# EAGLE design layoutprocessadorsch (EAGLE 9.0.0)
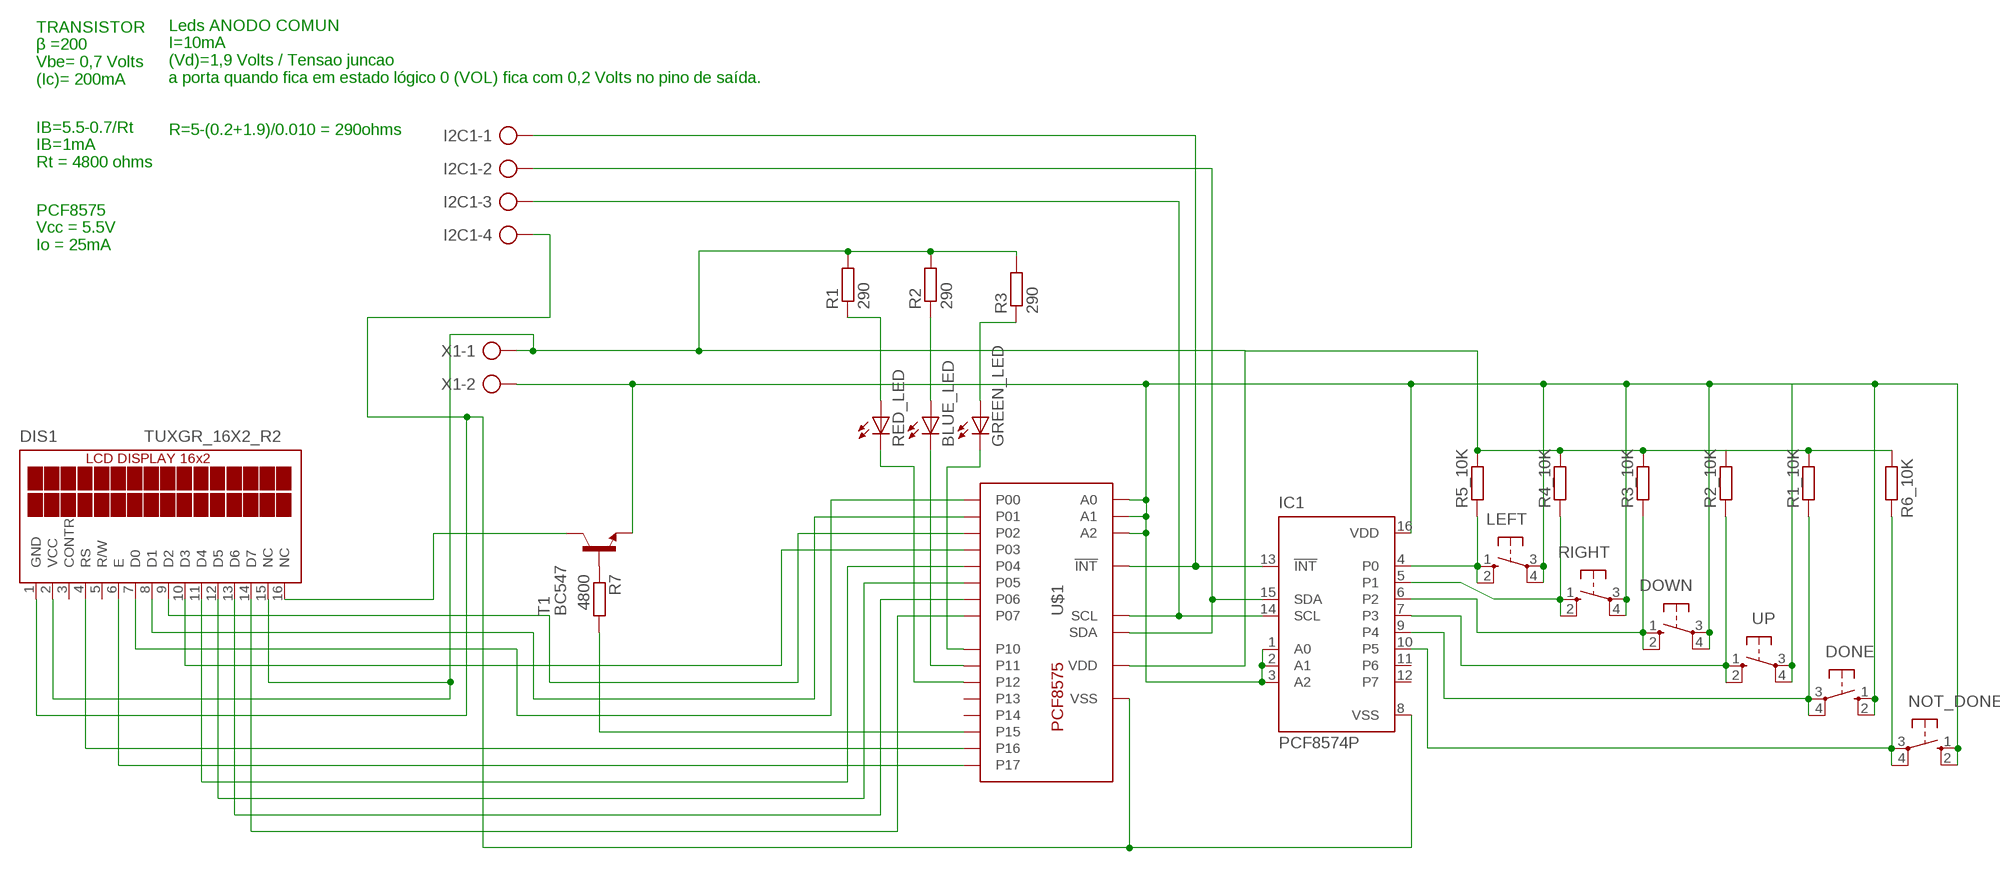
[diagram p0: schematic, sheet 1]

## Parts
BLUE_LED  LED5MM  [LED5MM]
DIS1  TUXGR_16X2_R2  [TUXGR_16X2_R2]
DONE  10-XX  [B3F-10XX]
DOWN  10-XX  [B3F-10XX]
GREEN_LED  LED5MM  [LED5MM]
I2C1  AK500/4-H  [AK500/4-H]
IC1  PCF8574P  [DIL16]
LEFT  10-XX  [B3F-10XX]
NOT_DONE  10-XX  [B3F-10XX]
R1  290  R-EU_0207/7  [0207/7]
R1_10K  R-EU_0207/7  [0207/7]
R2  290  R-EU_0207/7  [0207/7]
R2_10K  R-EU_0207/7  [0207/7]
R3  290  R-EU_0207/7  [0207/7]
R3_10K  R-EU_0207/7  [0207/7]
R4_10K  R-EU_0207/7  [0207/7]
R5_10K  R-EU_0207/7  [0207/7]
R6_10K  R-EU_0207/7  [0207/7]
R7  4800  R-EU_0207/7  [0207/7]
RED_LED  LED5MM  [LED5MM]
RIGHT  10-XX  [B3F-10XX]
T1  BC547  [TO92]
U$1  PCF8575C  [SOP24]
UP  10-XX  [B3F-10XX]
X1  AK500/2-H  [AK500/2-H]

## Nets
N$1: DIS1.14(D7) U$1.P$11(P07)
N$2: R7.1 T1.2(B)
N$3: I2C1.1 IC1.13(!INT) U$1.P$1(!INT)
N$4: I2C1.2 IC1.15(SDA) U$1.P$23(SDA)
N$5: DIS1.7(D0) U$1.P$4(P00)
N$6: DIS1.8(D1) U$1.P$5(P01)
N$7: DIS1.9(D2) U$1.P$6(P02)
N$8: DIS1.10(D3) U$1.P$7(P03)
N$9: DIS1.1(GND) I2C1.4 IC1.8(VSS) U$1.P$12(VSS)
N$10: DIS1.6(E) U$1.P$20(P17)
N$11: DIS1.4(RS) U$1.P$19(P16)
N$12: I2C1.3 IC1.14(SCL) U$1.P$22(SCL)
N$13: DIS1.11(D4) U$1.P$8(P04)
N$14: DIS1.12(D5) U$1.P$9(P05)
N$15: DIS1.13(D6) U$1.P$10(P06)
N$16: R7.2 U$1.P$18(P15)
N$17: DIS1.16(NC) T1.3(C)
N$18: GREEN_LED.K(C) U$1.P$13(P10)
N$19: IC1.4(P0) LEFT.1(S) LEFT.2(S1) R5_10K.1
N$20: IC1.5(P1) R4_10K.1 RIGHT.1(S) RIGHT.2(S1)
N$22: DOWN.1(S) DOWN.2(S1) IC1.6(P2) R3_10K.1
N$23: DIS1.2(VCC) DIS1.15(NC) R1.2 R1_10K.2 R2.2 R2_10K.2 R3.2 R3_10K.2 R4_10K.2 R5_10K.2 R6_10K.1 U$1.P$24(VDD) X1.1
N$24: DONE.3(P) DONE.4(P1) IC1.9(P4) R1_10K.1
N$26: IC1.10(P5) NOT_DONE.3(P) NOT_DONE.4(P1) R6_10K.2
N$28: IC1.7(P3) R2_10K.1 UP.1(S) UP.2(S1)
N$29: BLUE_LED.K(C) U$1.P$14(P11)
N$30: RED_LED.K(C) U$1.P$15(P12)
N$31: R1.1 RED_LED.A
N$32: BLUE_LED.A R2.1
N$33: GREEN_LED.A R3.1
N$35: DONE.1(S) DONE.2(S1) DOWN.3(P) DOWN.4(P1) IC1.1(A0) IC1.2(A1) IC1.3(A2) IC1.16(VDD) LEFT.3(P) LEFT.4(P1) NOT_DONE.1(S) NOT_DONE.2(S1) RIGHT.3(P) RIGHT.4(P1) T1.1(E) U$1.P$2(A1) U$1.P$3(A2) U$1.P$21(A0) UP.3(P) UP.4(P1) X1.2
Unconnected: DIS1.3(CONTR) DIS1.5(R/W) IC1.11(P6) IC1.12(P7) U$1.P$16(P13) U$1.P$17(P14)

## Notes on the sheet
- TRANSISTOR
  β =200
  Vbe= 0,7 Volts
  (Ic)= 200mA
- Leds ANODO COMUN
  I=10mA
  (Vd)=1,9 Volts / Tensao juncao
  a porta quando fica em estado lógico 0 (VOL) fica com 0,2 Volts no pino de saída.
  
  
  R=5-(0.2+1.9)/0.010 = 290ohms
- IB=5.5-0.7/Rt
  IB=1mA
  Rt = 4800 ohms
- PCF8575
  Vcc = 5.5V
  Io = 25mA

## Library data of the parts
BLUE_LED GREEN_LED RED_LED = led:LED: LED OSRAM: - CHIPLED LG R971, LG N971, LY N971, LG Q971, LY Q971, LO R971, LY R971 LH N974, LH R974 LS Q976, LO Q976, LY Q976 LO Q996 - Hyper CHIPLED LW Q18S LB Q993, LB Q99A, LB R99A - SideLED LS A670, LO A670, LY A670, LG A670, LP A670 LB A673, LV A673, LT A673, LW A673 LH A674 LY A675 LS A676, LA A676, LO A676, LY A676, LW A676 LS A679, LY A679, LG A679 - Hyper Micro SIDELED® LS Y876, LA Y876, LO Y876, LY Y876 LT Y87S - SmartLED LW L88C, LW L88S LB L89C, LB L89S, LG L890 LS L89K, LO L89K, LY L89K LS L896, LA L896, LO L896, LY L896 - TOPLED LS T670, LO T670, LY T670, LG T670, LP T670 LSG T670, LSP T670, LSY T670, LOP T670, LYG T670 LG T671, LOG T671, LSG T671 LB T673, LV T673, LT T673, LW T673 LH T674 LS T676, LA T676, LO T676, LY T676, LB T676, LH T676, LSB T676, LW T676 LB T67C, LV T67C, LT T67C, LS T67K, LO T67K, LY T67K, LW E67C LS E67B, LA E67B, LO E67B, LY E67B, LB E67C, LV E67C, LT E67C LW T67C LS T679, LY T679, LG T679 LS T770, LO T770, LY T770, LG T770, LP T770 LB T773, LV T773, LT T773, LW T773 LH T774 LS E675, LA E675, LY E675, LS T675 LS T776, LA T776, LO T776, LY T776, LB T776 LHGB T686 LT T68C, LB T68C - Hyper Mini TOPLED® LB M676 - Mini TOPLED Santana® LG M470 LS M47K, LO M47K, LY M47K Source: http://www.osram.convergy.de LUXEON: - LUMILED® LXK2-PW12-R00, LXK2-PW12-S00, LXK2-PW14-U00, LXK2-PW14-V00 LXK2-PM12-R00, LXK2-PM12-S00, LXK2-PM14-U00 LXK2-PE12-Q00, LXK2-PE12-R00, LXK2-PE12-S00, LXK2-PE14-T00, LXK2-PE14-U00 LXK2-PB12-K00, LXK2-PB12-L00, LXK2-PB12-M00, LXK2-PB14-N00, LXK2-PB14-P00, LXK2-PB14-Q00 LXK2-PR12-L00, LXK2-PR12-M00, LXK2-PR14-Q00, LXK2-PR14-R00 LXK2-PD12-Q00, LXK2-PD12-R00, LXK2-PD12-S00 LXK2-PH12-R00, LXK2-PH12-S00 LXK2-PL12-P00, LXK2-PL12-Q00, LXK2-PL12-R00 Source: www.luxeon.com KINGBRIGHT: KA-3528ASYC Source: www.kingbright.com
DIS1 = display-lcd:TUXGR_16X2_R2: Tuxgraphics LCD display 16x2 characters reflective, without background light Source: tuxgr_12x2_r2.pdf; OC_FARNELL: unknown; OC_NEWARK: unknown
DONE DOWN LEFT NOT_DONE RIGHT UP = switch-omron:10-XX: OMRON SWITCH; MPN: B3F-1000; OC_FARNELL: 176432; OC_NEWARK: 36M3542
I2C1 = con-ptr500:AK500/4-H: CONNECTOR Aug. 2004 / PTR Meßtechnik: Die Bezeichnung der Serie AK505 wurde geändert. Es handelt sich hierbei um AK500 in horizontaler Ausführung.; OC_FARNELL: unknown; OC_NEWARK: unknown
IC1 = micro-philips:PCF8574: I2C-Bus Remote 8-bit I/O expander http://www.semiconductors.philips.com/acrobat_download/datasheets/PCF8574_4.pdf; MPN: PCF8574PN; OC_FARNELL: 204020; OC_NEWARK: 11N8515; SPICEPREFIX: X
R1-R3 = resistor:R-EU_: RESISTOR, European symbol
R1_10K R2_10K R3_10K R4_10K R5_10K R6_10K R7 = rcl:R-EU_: RESISTOR, European symbol; SPICEPREFIX: R
T1 = transistor:BC547: NPN TRANSISTOR
U$1 = pcf8575c:PCF8575C
X1 = con-ptr500:AK500/2-H: CONNECTOR Aug. 2004 / PTR Meßtechnik: Die Bezeichnung der Serie AK505 wurde geändert. Es handelt sich hierbei um AK500 in horizontaler Ausführung.; OC_FARNELL: unknown; OC_NEWARK: unknown

## Board
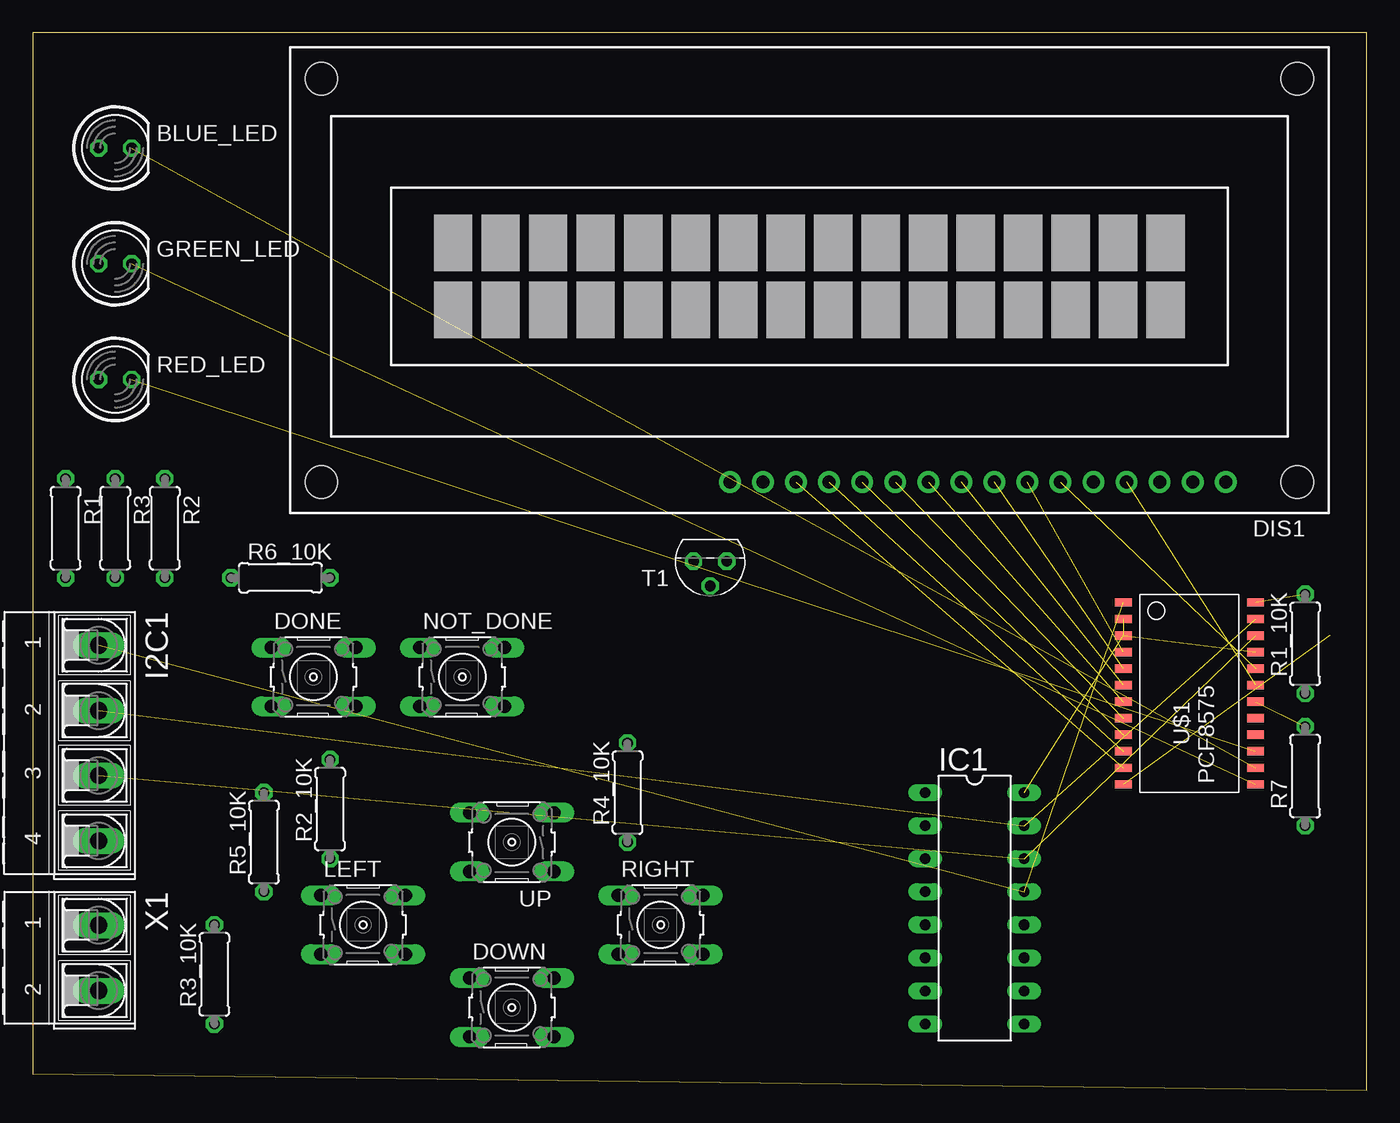
[diagram p1: board, top side]
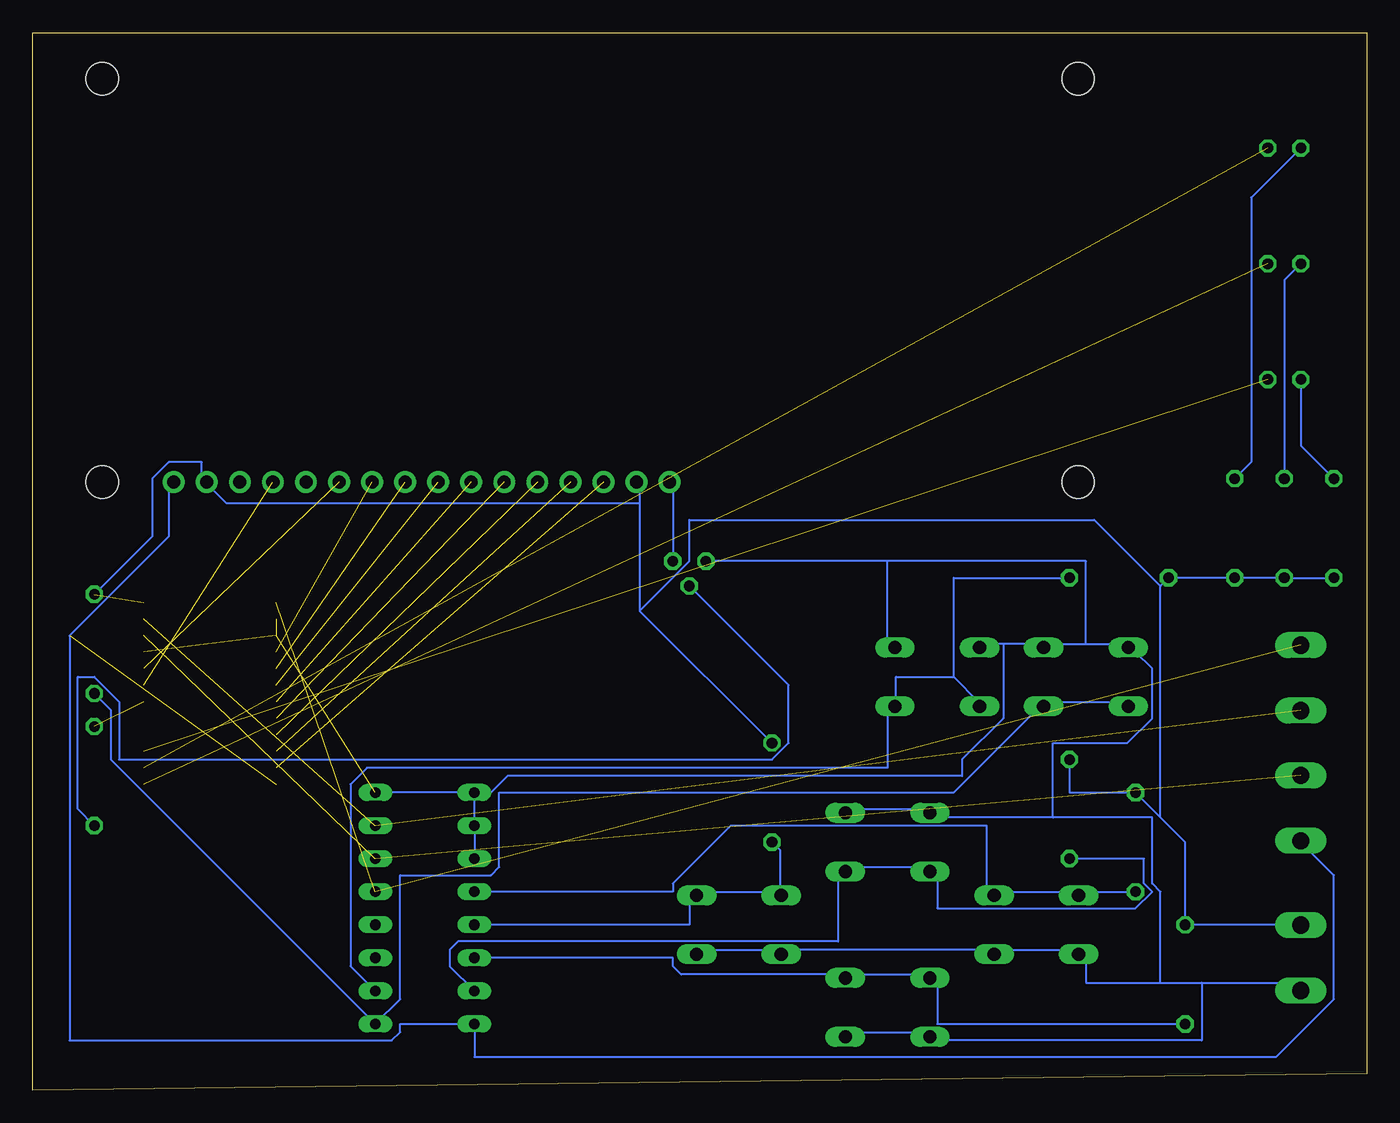
[diagram p2: board, bottom side, seen from below]

Size 102.54 x 81.27 mm. Coordinates in mm from the lower left corner, seen from the top.
Outline: 0,1.27 102.54,0 102.54,81.27 0,81.27 0,1.27
Copper layers (1*16): Top 0.035mm / dielectric 1.5mm / Bottom 0.035mm
Design rules "default": minimum track width 6mil, minimum drill 0.35mm, track to track 6mil, track to pad 6mil, pad to pad 6mil, via to via 6mil, smd to smd 6mil, copper to edge 40mil, drill to drill 6mil, minimum pad ring 10mil, minimum via ring 8mil, stop-mask expansion 4mil, vias tented up to drill 0mil, thermal gap 10mil

### Footprints (pad centres in the part's own frame; a part is rotated, then mirrored left to right if it is on the bottom)
LED5MM = drill 0.813 octagon: A -1.27,0; K 1.27,0
TUXGR_16X2_R2 = drill 1 pad 1.676: 1 -32,15.5; 2 -29.46,15.5; 3 -26.92,15.5; 4 -24.38,15.5; 5 -21.84,15.5; 6 -19.3,15.5; 7 -16.76,15.5; 8 -14.22,15.5; 9 -11.68,15.5; 10 -9.14,15.5; 11 -6.6,15.5; 12 -4.06,15.5; 13 -1.52,15.5; 14 1.02,15.5; 15 3.56,15.5; 16 6.1,15.5 | hole 2.5: -37.5,-15.5; 37.5,-15.5; -37.5,15.5; 37.5,15.5
B3F-10XX = drill 1.016 long: 1 -3.251,2.261; 2 3.251,2.261; 3 -3.251,-2.261; 4 3.251,-2.261
AK500/4-H = drill 1.321 long: 1 -7.518,0; 2 -2.489,0; 3 2.489,0; 4 7.518,0
DIL16 = drill 0.813 long: 1 -8.89,-3.81; 2 -6.35,-3.81; 3 -3.81,-3.81; 4 -1.27,-3.81; 5 1.27,-3.81; 6 3.81,-3.81; 7 6.35,-3.81; 8 8.89,-3.81; 9 8.89,3.81; 10 6.35,3.81; 11 3.81,3.81; 12 1.27,3.81; 13 -1.27,3.81; 14 -3.81,3.81; 15 -6.35,3.81; 16 -8.89,3.81
0207/7 = drill 0.813 octagon: 1 -3.81,0; 2 3.81,0
TO92 = drill 0.813 octagon: 1 1.27,0; 2 0,1.905; 3 -1.27,0
SOP24 = smd 1.27 x 0.635: P$1 -1.27,14.605; P$2 -1.27,13.335; P$3 -1.27,12.065; P$4 -1.27,10.795; P$5 -1.27,9.525; P$6 -1.27,8.255; P$7 -1.27,6.985; P$8 -1.27,5.715; P$9 -1.27,4.445; P$10 -1.27,3.175; P$11 -1.27,1.905; P$12 -1.27,0.635; P$13 8.89,0.635; P$14 8.89,1.905; P$15 8.89,3.175; P$16 8.89,4.445; P$17 8.89,5.715; P$18 8.89,6.985; P$19 8.89,8.255; P$20 8.89,9.525; P$21 8.89,10.795; P$22 8.89,12.065; P$23 8.89,13.335; P$24 8.89,14.605
AK500/2-H = drill 1.321 long: 1 -2.515,0; 2 2.515,0

### Placement (x,y rotation side)
BLUE_LED  6.35,72.39 0 top
DIS1  59.69,62.23 180 top
DONE  21.59,31.75 0 top
DOWN  36.83,6.35 0 top
GREEN_LED  6.35,63.5 0 top
I2C1  5.08,26.67 270 top
IC1  72.39,13.97 270 top
LEFT  25.4,12.7 0 top
NOT_DONE  33.02,31.75 0 top
R1  2.54,43.18 270 top
R1_10K  97.79,34.29 90 top
R2  10.16,43.18 270 top
R2_10K  22.86,21.59 90 top
R3  6.35,43.18 270 top
R3_10K  13.97,8.89 90 top
R4_10K  45.72,22.86 90 top
R5_10K  17.78,19.05 90 top
R6_10K  19.05,39.37 0 top
R7  97.79,24.13 90 top
RED_LED  6.35,54.61 0 top
RIGHT  48.26,12.7 0 top
T1  52.07,40.64 180 top
U$1  85.09,22.86 0 top
UP  36.83,19.05 180 top
X1  5.08,10.16 270 top

### Tracks (layer width: path | path; a pad name or v marks a point on that pad's centre or on a via)
N$1  (1 unrouted)
N$2
  Bottom 0.152: T1.2 44.45,31.11 44.45,26.67 45.72,25.4 95.89,25.4 95.89,29.84 97.79,31.75 99.06,31.75 99.06,21.59 R7.1
N$3  (2 unrouted)
N$4  (2 unrouted)
N$5  (1 unrouted)
N$6  (1 unrouted)
N$7  (1 unrouted)
N$8  (1 unrouted)
N$9  (1 unrouted)
  Bottom 0.152: DIS1.1 92.08,46.36 92.08,42.55 99.69,34.93 99.69,3.81 74.93,3.81 74.3,4.45 74.3,5.08 IC1.8 68.58,2.54 6.99,2.54 2.54,6.98 2.54,16.51 5.08,19.05 I2C1.4
N$10  (1 unrouted)
N$11  (1 unrouted)
N$12  (2 unrouted)
N$13  (1 unrouted)
N$14  (1 unrouted)
N$15  (1 unrouted)
N$16  (1 unrouted)
N$17
  Bottom 0.152: T1.3 53.34,46.36 DIS1.16
N$18  (1 unrouted)
N$19
  Bottom 0.152: R5_10K.1 21.59,15.24 LEFT.1 22.23,15.24 28.57,15.24 LEFT.2 29.21,15.24 29.21,20.32 48.9,20.32 53.34,15.88 53.34,15.24 IC1.4
N$20
  Bottom 0.152: R4_10K.1 45.09,18.41 45.09,15.24 | IC1.5 52.07,12.7 52.07,14.61 RIGHT.2 51.44,15.24 45.09,15.24 | 45.09,15.24 RIGHT.1
N$22
  Bottom 0.152: R3_10K.1 33.02,5.08 33.02,8.26 DOWN.1 33.66,8.89 40.01,8.89 DOWN.2 40.64,8.89 52.7,8.89 53.34,9.53 53.34,10.16 IC1.6
N$23  (1 unrouted)
  Bottom 0.152: R1.2 R3.2 R2.2 R6_10K.1 15.88,38.74 | R2_10K.2 22.86,22.86 R5_10K.2 15.88,20.95 | X1.1 5.08,12.7 R3_10K.2 13.97,19.05 15.88,20.95 | 15.88,20.95 15.88,38.74 | R1_10K.2 93.34,42.55 93.34,46.99 92.08,48.26 89.53,48.26 89.53,46.99 DIS1.2 88.9,46.36 87.63,45.09 55.88,45.09 | 55.88,36.83 R4_10K.2 | 55.88,45.09 55.88,46.36 DIS1.15 | 55.88,45.09 55.88,36.83 | 15.88,38.74 20.95,43.82 52.07,43.82 52.07,40.64 55.88,36.83
N$24
  Bottom 0.152: DONE.3 18.41,29.84 24.77,29.84 DONE.4 25.4,29.21 31.75,22.86 66.67,22.86 66.67,17.14 67.31,16.51 74.3,16.51 74.3,6.98 IC1.9 96.52,25.4 96.52,29.21 R1_10K.1
N$26
  Bottom 0.152: R6_10K.2 31.75,39.37 31.75,31.75 | 31.75,31.75 29.84,29.84 NOT_DONE.3 | IC1.10 78.11,9.53 78.11,23.5 76.83,24.77 36.83,24.77 36.83,29.21 NOT_DONE.4 36.2,29.84 36.2,31.75 31.75,31.75
N$28
  Bottom 0.152: R2_10K.1 17.14,17.78 17.14,15.88 16.51,15.24 17.78,13.97 33.02,13.97 33.02,16.51 UP.2 33.66,17.14 40.01,17.14 UP.1 40.64,16.51 40.64,11.43 69.85,11.43 70.48,10.79 70.48,9.53 IC1.7
N$29  (1 unrouted)
N$30  (1 unrouted)
N$31
  Bottom 0.152: R1.1 5.08,49.53 RED_LED.A
N$32
  Bottom 0.152: R2.1 8.89,48.26 8.89,68.58 BLUE_LED.A
N$33
  Bottom 0.152: R3.1 6.35,62.23 GREEN_LED.A
N$35  (3 unrouted)
  Bottom 0.152: 36.83,40.64 T1.1 | 36.83,40.64 36.83,34.29 NOT_DONE.2 | IC1.3 IC1.2 IC1.1 | IC1.1 IC1.16 | 21.59,34.29 24.77,34.29 DONE.2 25.4,34.29 27.94,34.29 | 21.59,34.29 18.41,34.29 DONE.1 17.78,33.66 16.51,32.38 16.51,28.57 18.41,26.67 24.13,26.67 24.13,20.95 | 27.94,34.29 29.21,34.29 NOT_DONE.1 | RIGHT.4 51.44,10.79 45.09,10.79 RIGHT.3 44.45,10.79 29.21,10.79 LEFT.4 28.57,10.79 22.23,10.79 LEFT.3 21.59,10.16 21.59,8.26 15.88,8.26 | UP.3 40.01,21.59 33.66,21.59 UP.4 33.02,20.95 24.13,20.95 | DOWN.4 40.01,4.45 33.66,4.45 DOWN.3 33.02,3.81 12.7,3.81 12.7,8.26 | 15.88,8.26 12.7,8.26 | 12.7,8.26 5.08,8.26 X1.2 | 24.13,20.95 16.51,20.95 16.51,15.88 15.88,15.24 15.88,8.26 | IC1.1 67.31,22.86 66.04,24.13 31.11,24.13 31.11,25.4 27.94,28.57 27.94,34.29 | 36.83,40.64 21.59,40.64 21.59,34.29